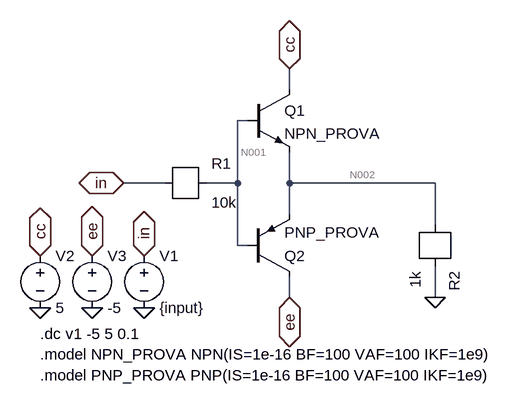
[diagram p0: schematic circuit_a_lt.asc]
circuit_a_lt.asc, the LTspice schematic file:
Version 4
SHEET 1 880 696
WIRE 416 128 416 96
WIRE 352 176 336 176
WIRE 224 272 160 272
WIRE 336 272 336 176
WIRE 336 272 288 272
WIRE 416 272 416 224
WIRE 640 272 416 272
WIRE 416 320 416 272
WIRE 640 336 640 272
WIRE 336 368 336 272
WIRE 352 368 336 368
WIRE 416 448 416 416
WIRE 640 448 640 400
FLAG 112 464 0
FLAG 32 464 0
FLAG 192 464 0
FLAG 32 384 cc
IOPIN 32 384 BiDir
FLAG 112 384 ee
IOPIN 112 384 BiDir
FLAG 192 384 in
IOPIN 192 384 BiDir
FLAG 416 448 ee
IOPIN 416 448 BiDir
FLAG 416 96 cc
IOPIN 416 96 BiDir
FLAG 160 272 in
IOPIN 160 272 BiDir
FLAG 640 448 0
SYMBOL voltage 192 368 R0
SYMATTR InstName V1
SYMATTR Value {input}
SYMBOL voltage 32 368 R0
SYMATTR InstName V2
SYMATTR Value 5
SYMBOL voltage 112 368 R0
SYMATTR InstName V3
SYMATTR Value -5
SYMBOL npn 352 128 R0
SYMATTR InstName Q1
SYMATTR Value NPN_PROVA
SYMBOL pnp 352 416 M180
SYMATTR InstName Q2
SYMATTR Value PNP_PROVA
SYMBOL r 224 272 R0
SYMATTR InstName R1
SYMATTR Value 10k
SYMBOL r 640 336 R90
SYMATTR InstName R2
SYMATTR Value 1k
TEXT 32 504 Left 2 !.dc v1 -5 5 0.1
TEXT 32 536 Left 2 !.model NPN_PROVA NPN(IS=1e-16 BF=100 VAF=100 IKF=1e9)
TEXT 32 568 Left 2 !.model PNP_PROVA PNP(IS=1e-16 BF=100 VAF=100 IKF=1e9)

The netlist it stands for:
* circuit_a_lt.asc
V1 in 0 {input}
V2 cc 0 5
V3 ee 0 -5
Q1 cc N001 N002 0 NPN_PROVA
Q2 ee N001 N002 0 PNP_PROVA
R1 N001 in 10k
R2 0 N002 1k
.model NPN NPN
.model PNP PNP
.lib standard.bjt
.dc v1 -5 5 0.1
.model NPN_PROVA NPN(IS=1e-16 BF=100 VAF=100 IKF=1e9)
.model PNP_PROVA PNP(IS=1e-16 BF=100 VAF=100 IKF=1e9)
.backanno
.end

* Results of the author's LTspice run, read from the files saved beside the schematic
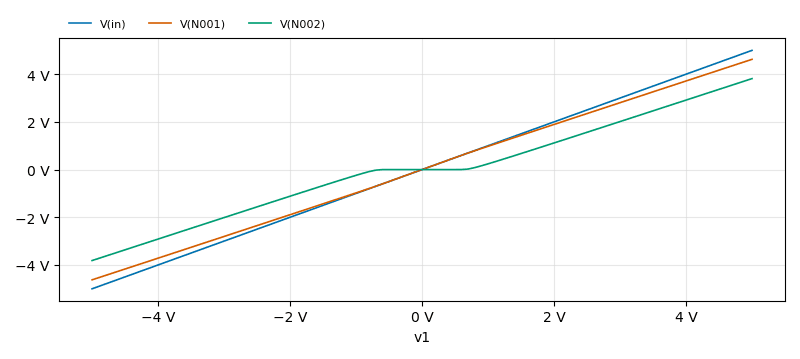
[diagram p1: DC transfer characteristic of circuit_a_lt.asc, plotted from the saved traces]
* DC transfer characteristic, 1 run:
*   V(in): -5 V at v1=-5 V, 5 V at v1=5 V, min -5 V, max 5 V
*   V(N001): -4.624 V at v1=-5 V, 4.624 V at v1=5 V, min -4.624 V, max 4.624 V
*   V(N002): -3.815 V at v1=-5 V, 3.815 V at v1=5 V, min -3.815 V, max 3.815 V